# Altium project RK3576J-MB.PrjPCB (part 2 of 7)

## Sheet PWR_PMIC.SchDoc
size 420 x 297 mm; Title1str: Модуль; PageSetup: Record=PageOptions|CenterHorizontal=False|CenterVertical=False|PrintScale=0.95|XCorrection=0.00|YCorrection=0.00|PrintKind=1|BorderSize=5000000|LeftOffset=0|BottomOffset=0|Orientation=1|PaperLength=1000|PaperWidth=1000|Scale=100|PaperSource=15|PrintQuality=600|MediaType=1|DitherType=10|PaperKind=A4|PrintScaleMode=1; Title2str: ATB-LW-USB-GateWay; Mass: ---; Letter1Column: О; Letter2Column: {L}; DocumentType1str: {Документ}; DocumentType2str: {Документ}; SpravNomer: {Справ. №}; Scale: 1:1; DocumentType: Схема электрическая принципиальная; SheetNumber: 7; SheetTotal: 32; DocumentTypeShort: Э3; DocumentInvertoryNumber: ㅤ
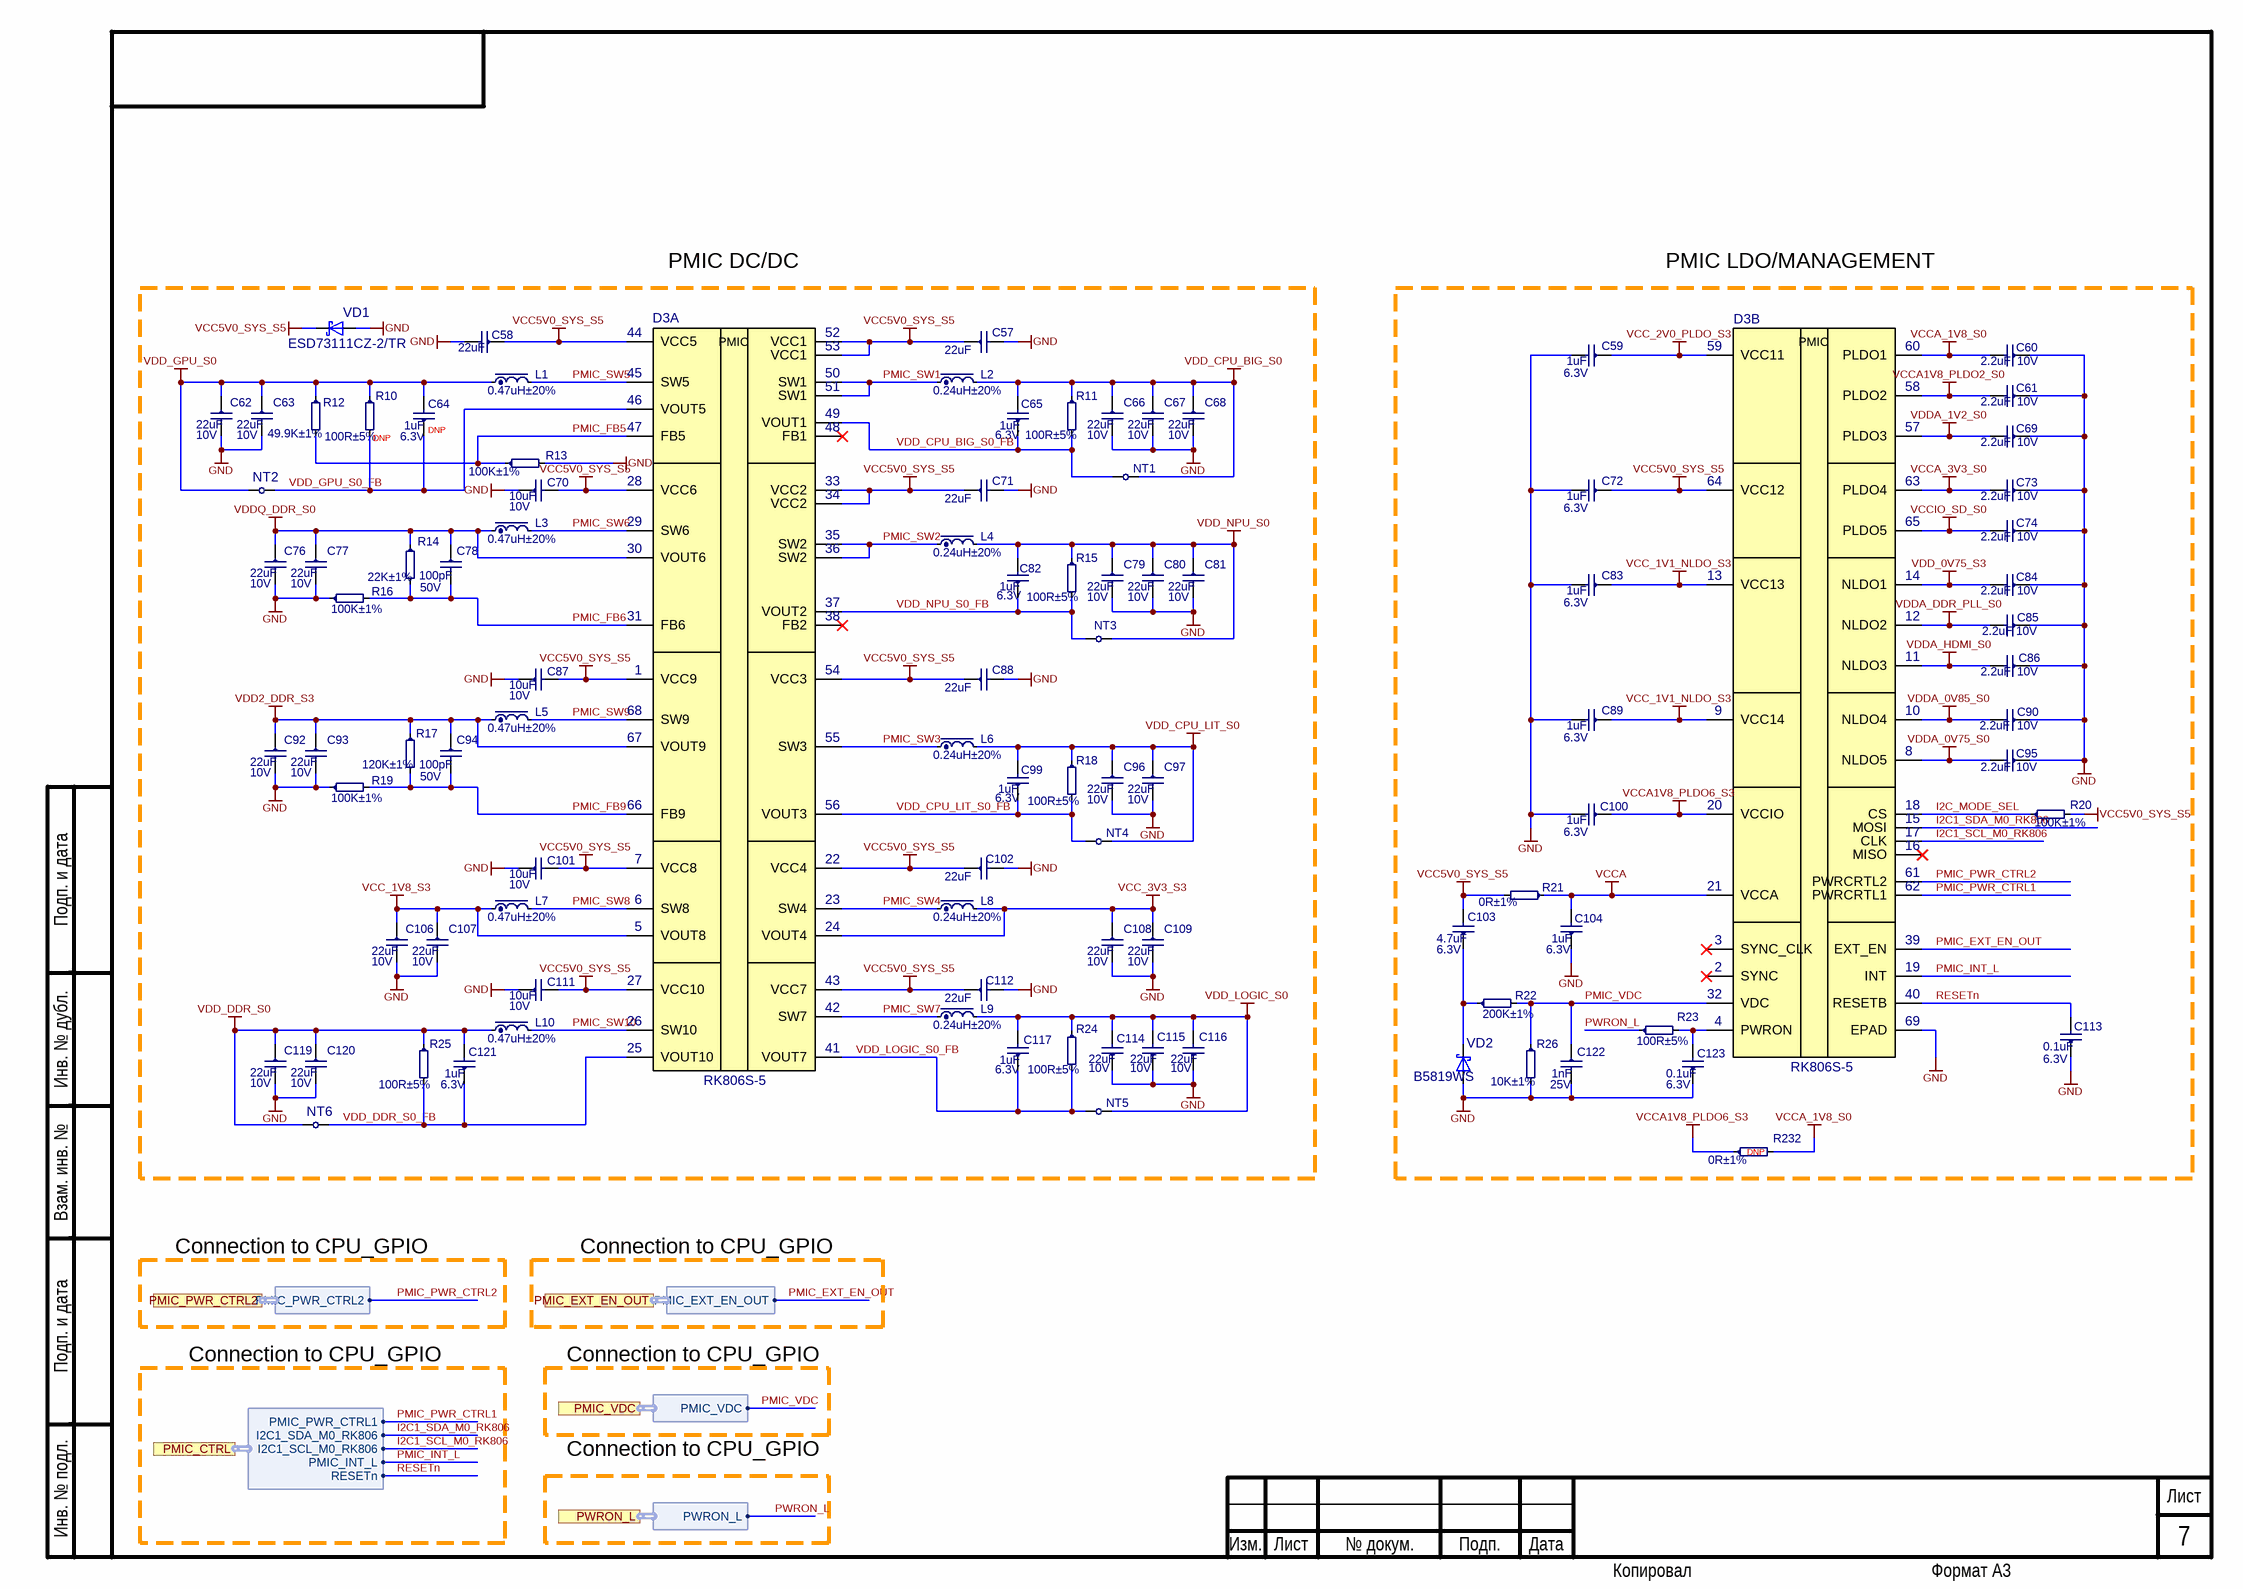
[diagram p4: PWR_PMIC.SchDoc]

### Parts
C57  22uF  [C0603]
C58  22uF  [C0603]
C59  1uF  Voltage: 6.3V  [C0201]
C60  2.2uF  Voltage: 10V  [C0402]
C61  2.2uF  Voltage: 10V  [C0402]
C62  22uF  Voltage: 10V  [C0603]
C63  22uF  Voltage: 10V  [C0603]
C64  1uF  Voltage: 6.3V  [C0201]
C65  1uF  Voltage: 6.3V  [C0201]
C66  22uF  Voltage: 10V  [C0603]
C67  22uF  Voltage: 10V  [C0603]
C68  22uF  Voltage: 10V  [C0603]
C69  2.2uF  Voltage: 10V  [C0402]
C70  10uF  Voltage: 10V  [C0603]
C71  22uF  [C0603]
C72  1uF  Voltage: 6.3V  [C0201]
C73  2.2uF  Voltage: 10V  [C0402]
C74  2.2uF  Voltage: 10V  [C0402]
C76  22uF  Voltage: 10V  [C0603]
C77  22uF  Voltage: 10V  [C0603]
C78  100pF  Voltage: 50V  [C0402]
C79  22uF  Voltage: 10V  [C0603]
C80  22uF  Voltage: 10V  [C0603]
C81  22uF  Voltage: 10V  [C0603]
C82  1uF  Voltage: 6.3V  [C0201]
C83  1uF  Voltage: 6.3V  [C0201]
C84  2.2uF  Voltage: 10V  [C0402]
C85  2.2uF  Voltage: 10V  [C0402]
C86  2.2uF  Voltage: 10V  [C0402]
C87  10uF  Voltage: 10V  [C0603]
C88  22uF  [C0603]
C89  1uF  Voltage: 6.3V  [C0201]
C90  2.2uF  Voltage: 10V  [C0402]
C92  22uF  Voltage: 10V  [C0603]
C93  22uF  Voltage: 10V  [C0603]
C94  100pF  Voltage: 50V  [C0402]
C95  2.2uF  Voltage: 10V  [C0402]
C96  22uF  Voltage: 10V  [C0603]
C97  22uF  Voltage: 10V  [C0603]
C99  1uF  Voltage: 6.3V  [C0201]
C100  1uF  Voltage: 6.3V  [C0201]
C101  10uF  Voltage: 10V  [C0603]
C102  22uF  [C0603]
C103  4.7uF  Voltage: 6.3V  [C0201]
C104  1uF  Voltage: 6.3V  [C0201]
C106  22uF  Voltage: 10V  [C0603]
C107  22uF  Voltage: 10V  [C0603]
C108  22uF  Voltage: 10V  [C0603]
C109  22uF  Voltage: 10V  [C0603]
C111  10uF  Voltage: 10V  [C0603]
C112  22uF  [C0603]
C113  0.1uF  Voltage: 6.3V  [C0201]
C114  22uF  Voltage: 10V  [C0603]
C115  22uF  Voltage: 10V  [C0603]
C116  22uF  Voltage: 10V  [C0603]
C117  1uF  Voltage: 6.3V  [C0201]
C119  22uF  Voltage: 10V  [C0603]
C120  22uF  Voltage: 10V  [C0603]
C121  1uF  Voltage: 6.3V  [C0201]
C122  1nF  Voltage: 25V  [C0201]
C123  0.1uF  Voltage: 6.3V  [C0201]
D3  RK806S-5  [RK806-1]  (parts A,B of 2)
L1  0.47uH±20%  [L0806]
L2  0.24uH±20%  [L0806]
L3  0.47uH±20%  [L0806]
L4  0.24uH±20%  [L0806]
L5  0.47uH±20%  [L0806]
L6  0.24uH±20%  [L0806]
L7  0.47uH±20%  [L0806]
L8  0.24uH±20%  [L0806]
L9  0.24uH±20%  [L0806]
L10  0.47uH±20%  [L0806]
NT1  (no value)  [NetTie_0.6mm_close]  (net tie, no BOM)
NT2  (no value)  [NetTie_0.6mm_close]  (net tie, no BOM)
NT3  (no value)  [NetTie_0.6mm_close]  (net tie, no BOM)
NT4  (no value)  [NetTie_0.6mm_close]  (net tie, no BOM)
NT5  (no value)  [NetTie_0.6mm_close]  (net tie, no BOM)
NT6  (no value)  [NetTie_0.6mm_close]  (net tie, no BOM)
R10  100R±5%  [R0201]
R11  100R±5%  [R0201]
R12  49.9K±1%  [R0402]
R13  100K±1%  [R0402]
R14  22K±1%  [R0402]
R15  100R±5%  [R0201]
R16  100K±1%  [R0402]
R17  120K±1%  [R0402]
R18  100R±5%  [R0201]
R19  100K±1%  [R0402]
R20  100K±1%  [R0201]
R21  0R±1%  [R0402]
R22  200K±1%  [R0201]
R23  100R±5%  [R0201]
R24  100R±5%  [R0201]
R25  100R±5%  [R0201]
R26  10K±1%  [R0201]
R232  0R±1%  [R0402]
VD1  ESD73111CZ-2/TR  [ESD73111CZ-2/TR]
VD2  B5819WS  [B5819WS]

### Ports
PMIC_CTRL (harness PMIC_CTRL), PMIC_EXT_EN_OUT (harness PMIC_EXT_EN_OUT), PMIC_PWR_CTRL2 (harness PMIC_PWR_CTRL2), PMIC_VDC (harness PMIC_VDC), PWRON_L (harness PWRON_L)

### Harnesses
PMIC_CTRL: I2C1_SDA_M0_RK806, I2C1_SCL_M0_RK806, PMIC_PWR_CTRL1, PMIC_INT_L, RESETn
PWRON_L: PWRON_L
PMIC_VDC: PMIC_VDC
PMIC_PWR_CTRL2: PMIC_PWR_CTRL2
PMIC_EXT_EN_OUT: PMIC_EXT_EN_OUT

### Nets
GND: C57.2 C58.2 C59.2 C60.1 C61.1 C62.2 C63.2 C66.2 C67.2 C68.2 C69.1 C70.1 C71.2 C72.2 C73.1 C74.1 C76.2 C77.2 C79.2 C80.2 C81.2 C83.2 C84.1 C85.1 C86.1 C87.1 C88.2 C89.2 C90.1 C92.2 C93.2 C95.1 C96.2 C97.2 C100.2 C101.1 C102.2 C104.1 C106.2 C107.2 C108.2 C109.2 C111.1 C112.2 C113.1 C114.1 C115.1 C116.1 C119.2 C120.2 C122.2 C123.1 D3.69(EPAD) R13.2 R16.1 R19.1 R26.2 VD1.2(A) VD2.2(A)
VCC5V0_SYS_S5: C57.1 C58.1 C70.2 C71.1 C72.1 C87.2 C88.1 C101.2 C102.1 C103.2 C111.2 C112.1 D3.1(VCC9) D3.7(VCC8) D3.22(VCC4) D3.27(VCC10) D3.28(VCC6) D3.33(VCC2) D3.34(VCC2) D3.43(VCC7) D3.44(VCC5) D3.52(VCC1) D3.53(VCC1) D3.54(VCC3) D3.64(VCC12) R20.2 R21.2 VD1.1(K)
VCC_1V1_NLDO_S3: C83.1 C89.1 D3.9(VCC14) D3.13(VCC13)
VCC_1V8_S3: C106.1 C107.1 D3.5(VOUT8) L7.1
VCC_2V0_PLDO_S3: C59.1 D3.59(VCC11)
VCC_3V3_S3: C108.1 C109.1 D3.24(VOUT4) L8.2
VCCA: C104.2 D3.21(VCCA) R21.1
VCCA1V8_PLDO2_S0: C61.2 D3.58(PLDO2)
VCCA1V8_PLDO6_S3: C100.1 D3.20(VCCIO) R232.1
VCCA_1V8_S0: C60.2 D3.60(PLDO1) R232.2
VCCA_3V3_S0: C73.2 D3.63(PLDO4)
VCCIO_SD_S0: C74.2 D3.65(PLDO5)
VDD2_DDR_S3: C92.1 C93.1 C94.1 D3.67(VOUT9) L5.1 R17.1
VDD_0V75_S3: C84.2 D3.14(NLDO1)
VDD_CPU_BIG_S0: C65.2 C66.1 C67.1 C68.1 L2.2 NT1.2 R11.1
VDD_CPU_LIT_S0: C96.1 C97.1 C99.2 L6.2 NT4.2 R18.1
VDD_DDR_S0: C119.1 C120.1 C121.2 L10.1 NT6.1 R25.1
VDD_GPU_S0: C62.1 C63.1 C64.2 L1.1 NT2.1 R10.1 R12.1
VDD_LOGIC_S0: C114.2 C115.2 C116.2 C117.2 L9.2 NT5.2 R24.1
VDD_NPU_S0: C79.1 C80.1 C81.1 C82.2 L4.2 NT3.2 R15.1
VDDA_0V75_S0: C95.2 D3.8(NLDO5)
VDDA_0V85_S0: C90.2 D3.10(NLDO4)
VDDA_1V2_S0: C69.2 D3.57(PLDO3)
VDDA_DDR_PLL_S0: C85.2 D3.12(NLDO2)
VDDA_HDMI_S0: C86.2 D3.11(NLDO3)
VDDQ_DDR_S0: C76.1 C77.1 C78.1 D3.30(VOUT6) L3.1 R14.1
I2C1_SCL_M0_RK806: D3.17(CLK) ; port PMIC_CTRL.I2C1_SCL_M0_RK806
I2C1_SDA_M0_RK806: D3.15(MOSI) ; port PMIC_CTRL.I2C1_SDA_M0_RK806
I2C_MODE_SEL: D3.18(CS) R20.1
PMIC_EXT_EN_OUT: D3.39(EXT_EN) ; port PMIC_EXT_EN_OUT.PMIC_EXT_EN_OUT
PMIC_FB5: D3.47(FB5) R12.2 R13.1
PMIC_FB6: C78.2 D3.31(FB6) R14.2 R16.2
PMIC_FB9: C94.2 D3.66(FB9) R17.2 R19.2
PMIC_INT_L: D3.19(INT) ; port PMIC_CTRL.PMIC_INT_L  [project net PMIC_CTRL.PMIC_INT_L]
PMIC_PWR_CTRL1: D3.62(PWRCRTL1) ; port PMIC_CTRL.PMIC_PWR_CTRL1  [project net PMIC_CTRL.PMIC_PWR_CTRL1]
PMIC_PWR_CTRL2: D3.61(PWRCRTL2) ; port PMIC_PWR_CTRL2.PMIC_PWR_CTRL2
PMIC_SW1: D3.50(SW1) D3.51(SW1) L2.1
PMIC_SW2: D3.35(SW2) D3.36(SW2) L4.1
PMIC_SW3: D3.55(SW3) L6.1
PMIC_SW4: D3.23(SW4) L8.1
PMIC_SW5: D3.45(SW5) L1.2
PMIC_SW6: D3.29(SW6) L3.2
PMIC_SW7: D3.42(SW7) L9.1
PMIC_SW8: D3.6(SW8) L7.2
PMIC_SW9: D3.68(SW9) L5.2
PMIC_SW10: D3.26(SW10) L10.2
PMIC_VDC: C122.1 D3.32(VDC) R22.2 R26.1 ; port PMIC_VDC.PMIC_VDC
PWRON_L: R23.1 ; port PWRON_L.PWRON_L
RESETn: C113.2 D3.40(RESETB) ; port PMIC_CTRL.RESETn  [project net PMIC_CTRL.RESETn]
VDD_CPU_BIG_S0_FB: C65.1 D3.49(VOUT1) NT1.1 R11.2
VDD_CPU_LIT_S0_FB: C99.1 D3.56(VOUT3) NT4.1 R18.2
VDD_DDR_S0_FB: C121.1 D3.25(VOUT10) NT6.2 R25.2
VDD_GPU_S0_FB: C64.1 D3.46(VOUT5) NT2.2 R10.2
VDD_LOGIC_S0_FB: C117.1 D3.41(VOUT7) NT5.1 R24.2
VDD_NPU_S0_FB: C82.1 D3.37(VOUT2) NT3.1 R15.2
NetC103_1: C103.1 R22.1 VD2.1(K)
NetC123_2: C123.2 D3.4(PWRON) R23.2

Not connected (* = marked no-connect by the designer): D3 2(SYNC)* 3(SYNC_CLK)* 16(MISO)* 38(FB2)* 48(FB1)*

### Notes on the sheet
- PMIC DC/DC
- PMIC LDO/MANAGEMENT
- (near R10) DNP
- (near C64) DNP
- (near R232) DNP
- Connection to CPU_GPIO
- Подп. и дата
- Инв. № дубл.
- Взам. инв. №
- Инв. № подл.
- Изм.
- Лист
- № докум.
- Подп.
- Дата
- Копировал
- Формат А3
- (in symbol RK806S-5, part A) PMIC
- (in symbol RK806S-5, part B) PMIC

### Library data of the parts
C57 C58 C71 C88 C102 C112 = 0603-X5R-10V-22uF±20%: *; Manufacturer: Samsung Electro-Mechanics; NameFromManufacturer: CL10A226MQ8NRNE; Dielectric: X5R; Voltage: 10V; Place: *); Tolerance: 20%; Check: False; Case: C0603; Part Number: 0603-X5R-10V-22uF±20%; Value: 22uF; Temperature: -55°C~85°C; ComponentLink2Description: Link to datasheet; ComponentLink1Description: DATASHEET; ComponentLink2URL: https://www.lcsc.com/product-detail/Multilayer-Ceramic-Capacitors-MLCC-SMD-SMT_Samsung-Electro-Mechanics-CL10A226MQ8NRNE_C159801.html; ComponentLink1URL: Datasheets/capacitors/1810261912_Samsung-Electro-Mechanics-CL10A226MQ8NRNE_C159801.pdf#Datasheets/capacitors/1810261912_Samsung-Electro-Mechanics-CL10A226MQ8NRNE_C159801.pdf#; Last changed: 05.12.2022
C59 C64 C65 C72 C82 C83 C89 C99 C100 C104 C117 C121 = 0201-X5R-6.3V-1uF±20%: Manufacturer: Murata Electronics; NameFromManufacturer: GRM033R60J105MEA2D; Dielectric: X5R; Place: *); Tolerance: 20%; Check: False; Case: C0201; Part Number: 0201-X5R-6.3V-1uF±20%; Value: 1uF; Temperature: -55°C~85°C; ComponentLink2Description: Link to datasheet; ComponentLink1Description: DATASHEET; ComponentLink2URL: https://www.terraelectronica.ru/product/1209278; ComponentLink1URL: Datasheets/capacitors/GRM033R60J105MEA2-61A.pdf; Last changed: 27.10.2022
C60 C61 C69 C73 C74 C84-C86 C90 C95 = 0402-X5R-10V-2.2uF±10%: *; Manufacturer: Yageo; NameFromManufacturer: CC0402KRX5R6BB225; Dielectric: X5R; Place: *); Tolerance: 10%; Check: False; Case: C0402; Part Number: 0402-X5R-10V-2.2uF±10%; Value: 2.2uF; Temperature: -55°C~85°C; ComponentLink2Description: Link to datasheet; ComponentLink1Description: DATASHEET; ComponentLink2URL: https://ru.mouser.com/ProductDetail/YAGEO/CC0402KRX5R6BB225?qs=%2Fha2pyFadujgDGyIaqGI8bfvbfiNNcC7p03y2QorR%252BZcRhliH8dUqw%3D%3D; ComponentLink1URL: Datasheets/capacitors/UPY-GPHC_X5R_4V-to-50V_27.pdf; Last changed: 27.10.2022
C62 C63 C66-C68 C76 C77 C79-C81 C92 C93 C96 C97 C106-C109 C114-C116 C119 C120 = 0603-X5R-10V-22uF±20%: *; Manufacturer: Samsung Electro-Mechanics; NameFromManufacturer: CL10A226MQ8NRNE; Dielectric: X5R; Place: *); Tolerance: 20%; Check: False; Case: C0603; Part Number: 0603-X5R-10V-22uF±20%; Value: 22uF; Temperature: -55°C~85°C; ComponentLink2Description: Link to datasheet; ComponentLink1Description: DATASHEET; ComponentLink2URL: https://www.lcsc.com/product-detail/Multilayer-Ceramic-Capacitors-MLCC-SMD-SMT_Samsung-Electro-Mechanics-CL10A226MQ8NRNE_C159801.html; ComponentLink1URL: Datasheets/capacitors/1810261912_Samsung-Electro-Mechanics-CL10A226MQ8NRNE_C159801.pdf#Datasheets/capacitors/1810261912_Samsung-Electro-Mechanics-CL10A226MQ8NRNE_C159801.pdf#; Last changed: 05.12.2022
C70 C87 C101 C111 = 0603-X5R-10V-10uF±10%: *; Manufacturer: Yageo; NameFromManufacturer: CC0603KRX5R6BB106; Dielectric: X5R; Place: *); Tolerance: 10%; Check: False; Case: C0603; Part Number: 0603-X5R-10V-10uF±10%; Value: 10uF; Temperature: -55°C~85°C; ComponentLink2Description: Link to datasheet; ComponentLink1Description: DATASHEET; ComponentLink2URL: https://www.yageo.com/upload/media/product/productsearch/datasheet/mlcc/UPY-GPHC_X5R_4V-to-50V_26.pdf; ComponentLink1URL: Datasheets/capacitors/UPY-GPHC_X5R_4V-to-50V_26.pdf; Last changed: 27.10.2022
C78 C94 = 0402-NP0-50V-100pF±1%: Manufacturer: Yageo; NameFromManufacturer: CC0402FRNPO9BN101; Dielectric: NP0; Place: *); Tolerance: 1%; Check: False; Case: C0402; Part Number: 0402-NP0-50V-100pF±1%; Value: 100pF; Temperature: -55°C~125°C; ComponentLink2Description: Link to datasheet; ComponentLink1Description: DATASHEET; ComponentLink2URL: https://www.yageo.com/upload/media/product/productsearch/datasheet/mlcc/UPY-GP_NP0_16V-to-50V_18.pdf; ComponentLink1URL: Datasheets/capacitors/UPY-GP_NP0_16V-to-50V_18.pdf; Last changed: 27.10.2022
C103 = 0201-X5R-6.3V-4.7uF±20%: Manufacturer: Murata Electronics; NameFromManufacturer: GRM035R60J475ME15D; Dielectric: X5R; Place: *); Tolerance: 20%; Check: False; Case: C0201; Part Number: 0201-X5R-6.3V-4.7uF±20%; Value: 4.7uF; Temperature: -55°C~85°C; ComponentLink2Description: Link to datasheet; ComponentLink1Description: DATASHEET; ComponentLink2URL: https://www.terraelectronica.ru/product/2272938; ComponentLink1URL: Datasheets/capacitors/GRM035R60J475ME15-01A.pdf; Last changed: 27.10.2022
C113 C123 = 0201-X5R-6.3V-0.1uF±10%: Manufacturer: Yageo; NameFromManufacturer: CC0201KRX5R5BB104; Dielectric: X5R; Place: *); Tolerance: 10%; Check: False; Case: C0201; Part Number: 0201-X5R-6.3V-0.1uF±10%; Value: 0.1uF; Temperature: -55°C~85°C; ComponentLink2Description: Link to datasheet; ComponentLink1Description: DATASHEET; ComponentLink2URL: https://www.terraelectronica.ru/product/1020032; ComponentLink1URL: Datasheets/capacitors/UPY-GPHC_X5R_4V-to-50V_27.pdf; Last changed: 27.10.2022
C122 = 0201-C0G-25V-100pF±5%: *; Part Number: 0201-C0G-25V-1nF±5%; Manufacturer: muRata; NameFromManufacturer: GRM0335C1E102JA01D; Dielectric: C0G; Place: *); Tolerance: 5%; Check: False; Case: C0201; Value: 1nF; Temperature: -55°C~125°C; ComponentLink2Description: Link to datasheet; ComponentLink1Description: DATASHEET; ComponentLink2URL: https://ru.mouser.com/ProductDetail/YAGEO/CC0201JRNPO8BN101?qs=%2Fha2pyFaduhl6p6a7Jtfij5kOT7C0BCbN0eDEcSOi5wWtTVDmUsGTw%3D%3D; ComponentLink1URL: Datasheets/capacitors/UPY-GP_NP0_16V-to-50V_18.pdf; Last changed: 27.10.2022
D3 = RK806S-5: Power Management; Manufacturer: Rockchip; Check: False; Part Number: RK806S-5; Value: RK806S-5; NameFromManufacturer: RK806S-5
L1 L3 L5 L7 L10 = 0806-5A-0.47uH±20%: Manufacturer: INPAQ; NameFromManufacturer: WIP201610P-R47ML; Current: 3.15A; Place: *); Value: 0.47uH; Tolerance: 20%; DC Resistance: 0.026R; Check: False; Case: XXXX; Part Number: 0806-5A-0.47uH±20%; Temperature: -55°C~125°C; ComponentLink1Description: DATASHEET; ComponentLink1URL: https://www.terraelectronica.ru/product/3409769; Datasheet: Datasheets/inductors/J(E)TE243A-0006.pdf; Last changed: 27.10.2022
L2 L4 L6 L8 L9 = 0806-5A-0.47uH±20%: Part Number: 0806-4.4A-0.24uH±20%; Manufacturer: cjiang; NameFromManufacturer: FPA201612D-R24MT0; Current: 4.4A; Place: *); Value: 0.24uH; Tolerance: 20%; DC Resistance: 0.026R; Check: False; Case: XXXX; Temperature: -55°C~125°C; ComponentLink1Description: DATASHEET; ComponentLink1URL: https://www.terraelectronica.ru/product/3409769; Datasheet: Datasheets/inductors/J(E)TE243A-0006.pdf; Last changed: 27.10.2022
NT1-NT6 = Перемычка закрытая_0.6мм: Check: False; Part Number: Перемычка закрытая_0.6мм; ComponentLink1Description: DATASHEET; Last changed: 06.05.2021
R10 R11 R15 R18 R23-R25 = 0201-0.05W-100R-200ppm-5%: *; NameFromManufacturer: RC0201JR-07100RL; Manufacturer: Yageo; Place: *); Value: 100R; Tolerance: 5%; Check: False; Case: R0201; Part Number: 0201-0.05W-100R-200ppm-5%; Temperature: -40°C~125°C; ComponentLink1Description: DATASHEET; ComponentLink1URL: https://www.terraelectronica.ru/product/431790; Datasheet: Datasheets/resistors/PYu-RC_Group_51_RoHS_L_11.pdf; Last changed: 27.10.2022
R12 = 0402-0.0625W-49.9K-100ppm±1%: Chip Resistor 0402 49.9kΩ ±1% 50V ±100ppm/℃ Thick Film; NameFromManufacturer: RC0402FR-0749K9L; Manufacturer: Yageo; Place: *); Value: 49.9K; Check: False; Case: R0402; Part Number: 0402-0.0625W-49.9K-100ppm±1%; Tolerance: 1%; Temperature: -55°C~155°C; ComponentLink1Description: DATASHEET; ComponentLink1URL: https://www.terraelectronica.ru/product/562862; Datasheet: Datasheets/resistors/PYu-RC_Group_51_RoHS_L_11.pdf; Last changed: 27.10.2022
R13 R16 R19 = 0402-0.0625W-100K-100ppm±1%: Chip Resistor 0402 100kΩ ±1% 50V ±100ppm/℃ Thick Film; NameFromManufacturer: RC0402FR-07100KL; Manufacturer: Yageo; Place: *); Value: 100K; Check: False; Case: R0402; Part Number: 0402-0.0625W-100K-100ppm±1%; Tolerance: 1%; Temperature: -55°C~155°C; ComponentLink1Description: DATASHEET; ComponentLink1URL: https://www.yageo.com/upload/media/product/productsearch/datasheet/rchip/PYu-RC_Group_51_RoHS_L_11.pdf; Datasheet: Datasheets/resistors/PYu-RC_Group_51_RoHS_L_11.pdf; Last changed: 27.10.2022
R14 = 0402-0.0625W-22K-100ppm±1%: *; NameFromManufacturer: RC0402FR-0722KL; Manufacturer: Yageo; Place: *); Value: 22K; Tolerance: 1%; Check: False; Case: R0402; Part Number: 0402-0.0625W-22K-100ppm±1%; Temperature: -55°C~155°C; ComponentLink1Description: DATASHEET; ComponentLink1URL: https://www.digikey.com/en/products/detail/yageo/RC0402FR-0722KL/726561?s=N4IgTCBcDaIEoGEAMAWJYBicC0SDsYYA0gDIgC6AvkA; Datasheet: Datasheets/resistors/PYu-RC_Group_51_RoHS_L_11.pdf; Last changed: 27.10.2022
R17 = 0402-0.0625W-120K-100ppm±1%: NameFromManufacturer: RC0402FR-07120KL; Manufacturer: Yageo; Place: *); Value: 120K; Tolerance: 1%; Check: False; Case: R0402; Part Number: 0402-0.0625W-120K-100ppm±1%; Temperature: -55°C~155°C; ComponentLink1Description: DATASHEET; ComponentLink1URL: https://eu.mouser.com/ProductDetail/YAGEO/RC0402FR-07120KL?qs=sxZXDnvRBEiD8SsZ%252BM9D1g%3D%3D; Datasheet: Datasheets/resistors/PYu-RC_Group_51_RoHS_L_11.pdf; Last changed: 27.10.2022
R20 = 0201-0.05W-0R-100ppm-5%: *; Part Number: 0201-0.05W-100K-5%; NameFromManufacturer: RC0201FR-07100KL; Manufacturer: Yageo; Place: *); Value: 100K; Tolerance: 1%; Check: False; Case: R0201; Temperature: -40°C~125°C; ComponentLink1Description: DATASHEET; ComponentLink1URL: https://www.digikey.com/en/products/detail/yageo/RC0201JR-070RL/1948898; Datasheet: Datasheets/resistors/PYu-RC_Group_51_RoHS_L_11.pdf+BB3:B271; Last changed: 27.10.2022
R21 R232 = 0402-0.0625W-0R-100ppm±1%: as R52 on sheet PWR_MAIN; Case: R0402; Part Number: 0402-0.0625W-0R-100ppm±1%; Tolerance: 1%; Temperature: -55°C~155°C; ComponentLink1Description: DATASHEET; ComponentLink1URL: https://www.chipdip.ru/product0/8000617426?ysclid=l7og5x0plo427794326; Datasheet: Datasheets/resistors/DOC012445956.pdf; Last changed: 27.10.2022
R22 = 0201-0.05W-0R-100ppm-5%: *; Part Number: 0201-0.05W-200K-100ppm-1%; NameFromManufacturer: RC0201FR-07200KL; Manufacturer: Yageo; Place: *); Value: 200K; Tolerance: 1%; Check: False; Case: R0201; Temperature: -40°C~125°C; ComponentLink1Description: DATASHEET; ComponentLink1URL: https://www.digikey.com/en/products/detail/yageo/RC0201JR-070RL/1948898; Datasheet: Datasheets/resistors/PYu-RC_Group_51_RoHS_L_11.pdf+BB3:B271; Last changed: 27.10.2022
R26 = 0201-0.05W-0R-100ppm-5%: *; Part Number: 0201-0.05W-10K-100ppm-1%; NameFromManufacturer: RC0201FR-0710KL; Manufacturer: Yageo; Place: *); Value: 10K; Tolerance: 1%; Check: False; Case: R0201; Temperature: -40°C~125°C; ComponentLink1Description: DATASHEET; ComponentLink1URL: https://www.digikey.com/en/products/detail/yageo/RC0201JR-070RL/1948898; Datasheet: Datasheets/resistors/PYu-RC_Group_51_RoHS_L_11.pdf+BB3:B271; Last changed: 27.10.2022
VD1 = ESD73111CZ-2/TR: 6.5VC Clamp 6A@8/20us Ipp ESD DIODE DWN0603-2L; Manufacturer: WILLSEMI; Check: False; Part Number: ESD73111CZ-2/TR; Value: ESD73111CZ-2/TR; NameFromManufacturer: ESD73111CZ-2/TR
VD2 = B5819WS: Rectifier Diode, Schottky, 1 Phase, 1 Element, 1A, 40V V(RRM), Silicon; Check: False; Part Number: B5819WS; Value: B5819WS; NameFromManufacturer: B5819WS

## Sheet PWR_CPU.SchDoc
size 420 x 297 mm; Scale: 1:1; DocumentType: Схема электрическая принципиальная; SheetNumber: 8; SheetTotal: 32; DocumentTypeShort: Э3; DocumentInvertoryNumber: ㅤ
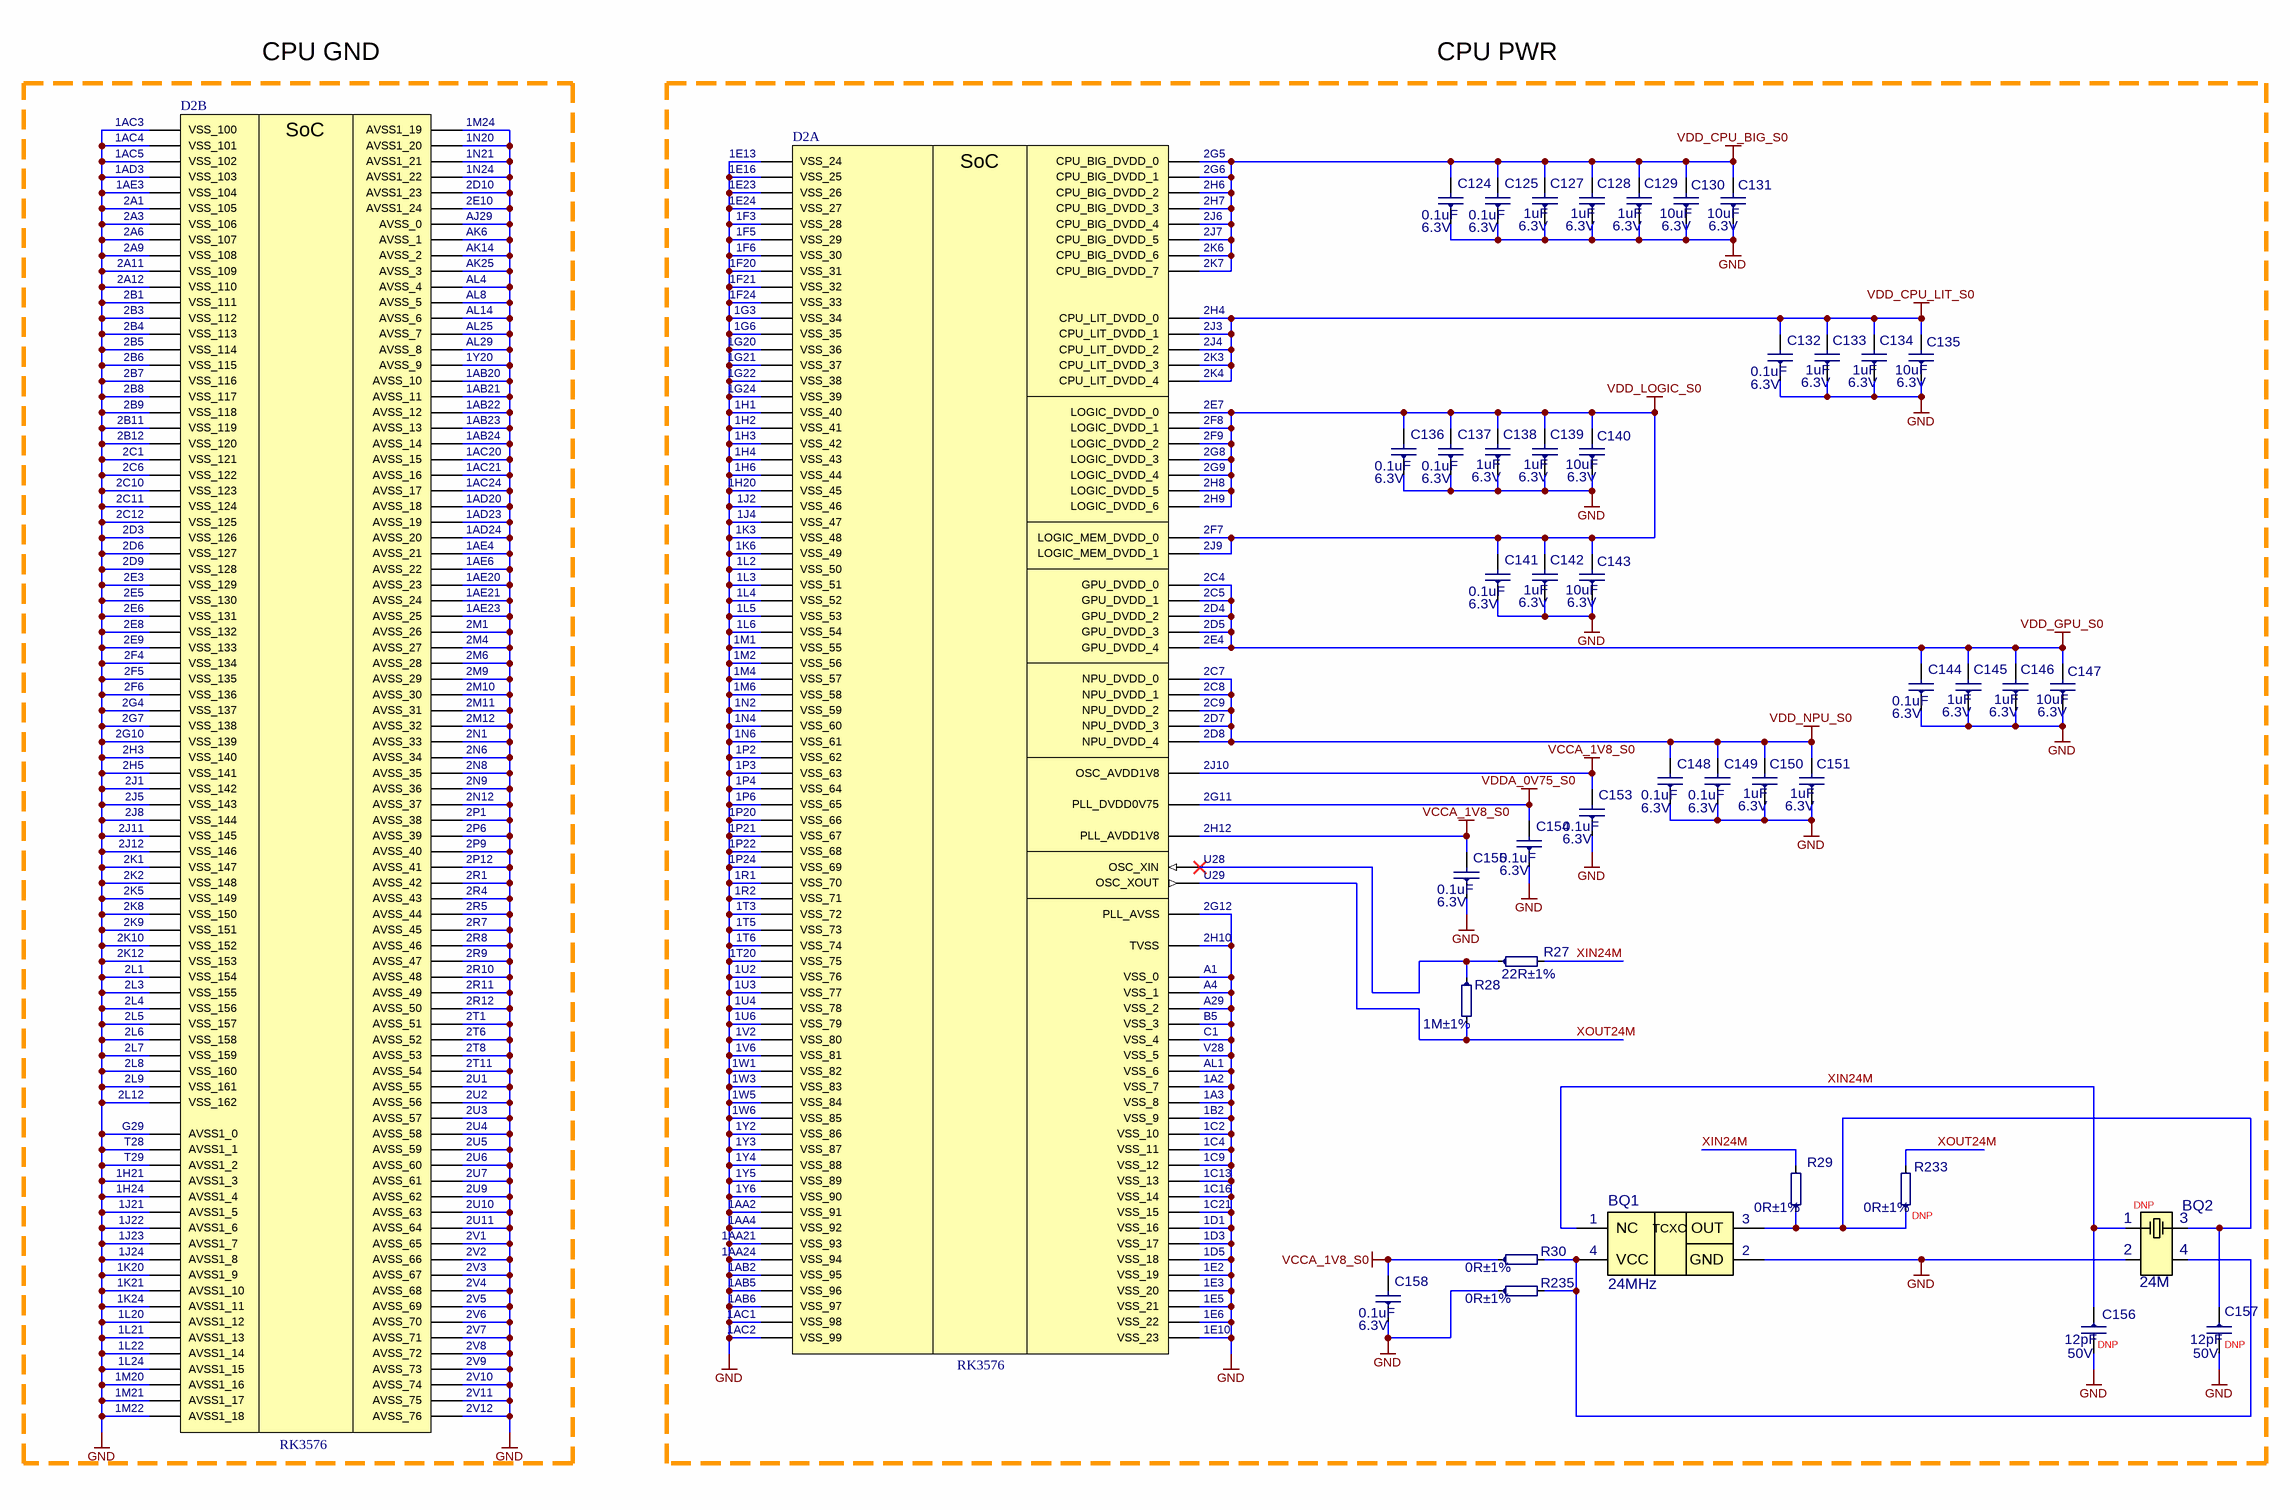
[diagram p5: PWR_CPU.SchDoc]

### Parts
BQ1  24MHz  [TC32S4-24.000-0618NQDTN]
BQ2  24M  [NX3225GA]
C124  0.1uF  Voltage: 6.3V  [C0201]
C125  0.1uF  Voltage: 6.3V  [C0201]
C127  1uF  Voltage: 6.3V  [C0201]
C128  1uF  Voltage: 6.3V  [C0201]
C129  1uF  Voltage: 6.3V  [C0201]
C130  10uF  Voltage: 6.3V  [C0402]
C131  10uF  Voltage: 6.3V  [C0402]
C132  0.1uF  Voltage: 6.3V  [C0201]
C133  1uF  Voltage: 6.3V  [C0201]
C134  1uF  Voltage: 6.3V  [C0201]
C135  10uF  Voltage: 6.3V  [C0402]
C136  0.1uF  Voltage: 6.3V  [C0201]
C137  0.1uF  Voltage: 6.3V  [C0201]
C138  1uF  Voltage: 6.3V  [C0201]
C139  1uF  Voltage: 6.3V  [C0201]
C140  10uF  Voltage: 6.3V  [C0402]
C141  0.1uF  Voltage: 6.3V  [C0201]
C142  1uF  Voltage: 6.3V  [C0201]
C143  10uF  Voltage: 6.3V  [C0402]
C144  0.1uF  Voltage: 6.3V  [C0201]
C145  1uF  Voltage: 6.3V  [C0201]
C146  1uF  Voltage: 6.3V  [C0201]
C147  10uF  Voltage: 6.3V  [C0402]
C148  0.1uF  Voltage: 6.3V  [C0201]
C149  0.1uF  Voltage: 6.3V  [C0201]
C150  1uF  Voltage: 6.3V  [C0201]
C151  1uF  Voltage: 6.3V  [C0201]
C153  0.1uF  Voltage: 6.3V  [C0201]
C154  0.1uF  Voltage: 6.3V  [C0201]
C155  0.1uF  Voltage: 6.3V  [C0201]
C156  12pF  Voltage: 50V  [C0402]
C157  12pF  Voltage: 50V  [C0402]
C158  0.1uF  Voltage: 6.3V  [C0201]
D2  RK3576  [BGAFCCSP698L]  (parts A,B of 7)
R27  22R±1%  [R0402]
R28  1M±1%  [R0402]
R29  0R±1%  [R0402]
R30  0R±1%  [R0402]
R233  0R±1%  [R0402]
R235  0R±1%  [R0402]

### Nets
GND: BQ1.2(GND) BQ2.2 C124.1 C125.1 C127.1 C128.1 C129.1 C130.1 C131.1 C132.1 C133.1 C134.1 C135.1 C136.1 C137.1 C138.1 C139.1 C140.1 C141.1 C142.1 C143.1 C144.1 C145.1 C146.1 C147.1 C148.1 C149.1 C150.1 C151.1 C153.1 C154.1 C155.1 C156.2 C157.2 C158.1 D2.1A2(VSS_7) D2.1A3(VSS_8) D2.1AA2(VSS_91) D2.1AA4(VSS_92) D2.1AA21(VSS_93) D2.1AA24(VSS_94) D2.1AB2(VSS_95) D2.1AB5(VSS_96) D2.1AB6(VSS_97) D2.1AB20(AVSS_10) D2.1AB21(AVSS_11) D2.1AB22(AVSS_12) D2.1AB23(AVSS_13) D2.1AB24(AVSS_14) D2.1AC1(VSS_98) D2.1AC2(VSS_99) D2.1AC3(VSS_100) D2.1AC4(VSS_101) D2.1AC5(VSS_102) D2.1AC20(AVSS_15) D2.1AC21(AVSS_16) D2.1AC24(AVSS_17) D2.1AD3(VSS_103) D2.1AD20(AVSS_18) D2.1AD23(AVSS_19) D2.1AD24(AVSS_20) D2.1AE3(VSS_104) D2.1AE4(AVSS_21) D2.1AE6(AVSS_22) D2.1AE20(AVSS_23) D2.1AE21(AVSS_24) D2.1AE23(AVSS_25) D2.1B2(VSS_9) D2.1C2(VSS_10) D2.1C4(VSS_11) D2.1C9(VSS_12) D2.1C13(VSS_13) D2.1C16(VSS_14) D2.1C21(VSS_15) D2.1D1(VSS_16) D2.1D3(VSS_17) D2.1D5(VSS_18) D2.1E2(VSS_19) D2.1E3(VSS_20) D2.1E5(VSS_21) D2.1E6(VSS_22) D2.1E10(VSS_23) D2.1E13(VSS_24) D2.1E16(VSS_25) D2.1E23(VSS_26) D2.1E24(VSS_27) D2.1F3(VSS_28) D2.1F5(VSS_29) D2.1F6(VSS_30) D2.1F20(VSS_31) D2.1F21(VSS_32) D2.1F24(VSS_33) D2.1G3(VSS_34) D2.1G6(VSS_35) D2.1G20(VSS_36) D2.1G21(VSS_37) D2.1G22(VSS_38) D2.1G24(VSS_39) D2.1H1(VSS_40) D2.1H2(VSS_41) D2.1H3(VSS_42) D2.1H4(VSS_43) D2.1H6(VSS_44) D2.1H20(VSS_45) D2.1H21(AVSS1_3) D2.1H24(AVSS1_4) D2.1J2(VSS_46) D2.1J4(VSS_47) D2.1J21(AVSS1_5) D2.1J22(AVSS1_6) D2.1J23(AVSS1_7) D2.1J24(AVSS1_8) D2.1K3(VSS_48) D2.1K6(VSS_49) D2.1K20(AVSS1_9) D2.1K21(AVSS1_10) D2.1K24(AVSS1_11) D2.1L2(VSS_50) D2.1L3(VSS_51) D2.1L4(VSS_52) D2.1L5(VSS_53) D2.1L6(VSS_54) D2.1L20(AVSS1_12) D2.1L21(AVSS1_13) D2.1L22(AVSS1_14) D2.1L24(AVSS1_15) D2.1M1(VSS_55) D2.1M2(VSS_56) D2.1M4(VSS_57) D2.1M6(VSS_58) D2.1M20(AVSS1_16) D2.1M21(AVSS1_17) D2.1M22(AVSS1_18) D2.1M24(AVSS1_19) D2.1N2(VSS_59) D2.1N4(VSS_60) D2.1N6(VSS_61) D2.1N20(AVSS1_20) D2.1N21(AVSS1_21) D2.1N24(AVSS1_22) D2.1P2(VSS_62) D2.1P3(VSS_63) D2.1P4(VSS_64) D2.1P6(VSS_65) D2.1P20(VSS_66) D2.1P21(VSS_67) D2.1P22(VSS_68) D2.1P24(VSS_69) D2.1R1(VSS_70) D2.1R2(VSS_71) D2.1T3(VSS_72) D2.1T5(VSS_73) D2.1T6(VSS_74) D2.1T20(VSS_75) D2.1U2(VSS_76) D2.1U3(VSS_77) D2.1U4(VSS_78) D2.1U6(VSS_79) D2.1V2(VSS_80) D2.1V6(VSS_81) D2.1W1(VSS_82) D2.1W3(VSS_83) D2.1W5(VSS_84) D2.1W6(VSS_85) D2.1Y2(VSS_86) D2.1Y3(VSS_87) D2.1Y4(VSS_88) D2.1Y5(VSS_89) D2.1Y6(VSS_90) D2.1Y20(AVSS_9) D2.2A1(VSS_105) D2.2A3(VSS_106) D2.2A6(VSS_107) D2.2A9(VSS_108) D2.2A11(VSS_109) D2.2A12(VSS_110) D2.2B1(VSS_111) D2.2B3(VSS_112) D2.2B4(VSS_113) D2.2B5(VSS_114) D2.2B6(VSS_115) D2.2B7(VSS_116) D2.2B8(VSS_117) D2.2B9(VSS_118) D2.2B11(VSS_119) D2.2B12(VSS_120) D2.2C1(VSS_121) D2.2C6(VSS_122) D2.2C10(VSS_123) D2.2C11(VSS_124) D2.2C12(VSS_125) D2.2D3(VSS_126) D2.2D6(VSS_127) D2.2D9(VSS_128) D2.2D10(AVSS1_23) D2.2E3(VSS_129) D2.2E5(VSS_130) D2.2E6(VSS_131) D2.2E8(VSS_132) D2.2E9(VSS_133) D2.2E10(AVSS1_24) D2.2F4(VSS_134) D2.2F5(VSS_135) D2.2F6(VSS_136) D2.2G4(VSS_137) D2.2G7(VSS_138) D2.2G10(VSS_139) D2.2G12(PLL_AVSS) D2.2H3(VSS_140) D2.2H5(VSS_141) D2.2H10(TVSS) D2.2J1(VSS_142) D2.2J5(VSS_143) D2.2J8(VSS_144) D2.2J11(VSS_145) D2.2J12(VSS_146) D2.2K1(VSS_147) D2.2K2(VSS_148) D2.2K5(VSS_149) D2.2K8(VSS_150) D2.2K9(VSS_151) D2.2K10(VSS_152) D2.2K12(VSS_153) D2.2L1(VSS_154) D2.2L3(VSS_155) D2.2L4(VSS_156) D2.2L5(VSS_157) D2.2L6(VSS_158) D2.2L7(VSS_159) D2.2L8(VSS_160) D2.2L9(VSS_161) D2.2L12(VSS_162) D2.2M1(AVSS_26) D2.2M4(AVSS_27) D2.2M6(AVSS_28) D2.2M9(AVSS_29) D2.2M10(AVSS_30) D2.2M11(AVSS_31) D2.2M12(AVSS_32) D2.2N1(AVSS_33) D2.2N6(AVSS_34) D2.2N8(AVSS_35) D2.2N9(AVSS_36) D2.2N12(AVSS_37) D2.2P1(AVSS_38) D2.2P6(AVSS_39) D2.2P9(AVSS_40) D2.2P12(AVSS_41) D2.2R1(AVSS_42) D2.2R4(AVSS_43) D2.2R5(AVSS_44) D2.2R7(AVSS_45) D2.2R8(AVSS_46) D2.2R9(AVSS_47) D2.2R10(AVSS_48) D2.2R11(AVSS_49) D2.2R12(AVSS_50) D2.2T1(AVSS_51) D2.2T6(AVSS_52) D2.2T8(AVSS_53) D2.2T11(AVSS_54) D2.2U1(AVSS_55) D2.2U2(AVSS_56) D2.2U3(AVSS_57) D2.2U4(AVSS_58) D2.2U5(AVSS_59) D2.2U6(AVSS_60) D2.2U7(AVSS_61) D2.2U9(AVSS_62) D2.2U10(AVSS_63) D2.2U11(AVSS_64) D2.2V1(AVSS_65) D2.2V2(AVSS_66) D2.2V3(AVSS_67) D2.2V4(AVSS_68) D2.2V5(AVSS_69) D2.2V6(AVSS_70) D2.2V7(AVSS_71) D2.2V8(AVSS_72) D2.2V9(AVSS_73) D2.2V10(AVSS_74) D2.2V11(AVSS_75) D2.2V12(AVSS_76) D2.A1(VSS_0) D2.A4(VSS_1) D2.A29(VSS_2) D2.AJ29(AVSS_0) D2.AK6(AVSS_1) D2.AK14(AVSS_2) D2.AK25(AVSS_3) D2.AL1(VSS_6) D2.AL4(AVSS_4) D2.AL8(AVSS_5) D2.AL14(AVSS_6) D2.AL25(AVSS_7) D2.AL29(AVSS_8) D2.B5(VSS_3) D2.C1(VSS_4) D2.G29(AVSS1_0) D2.T28(AVSS1_1) D2.T29(AVSS1_2) D2.V28(VSS_5) R235.1
VCCA_1V8_S0: C153.2 C155.2 C158.2 D2.2H12(PLL_AVDD1V8) D2.2J10(OSC_AVDD1V8) R30.1
VDD_CPU_BIG_S0: C124.2 C125.2 C127.2 C128.2 C129.2 C130.2 C131.2 D2.2G5(CPU_BIG_DVDD_0) D2.2G6(CPU_BIG_DVDD_1) D2.2H6(CPU_BIG_DVDD_2) D2.2H7(CPU_BIG_DVDD_3) D2.2J6(CPU_BIG_DVDD_4) D2.2J7(CPU_BIG_DVDD_5) D2.2K6(CPU_BIG_DVDD_6) D2.2K7(CPU_BIG_DVDD_7)
VDD_CPU_LIT_S0: C132.2 C133.2 C134.2 C135.2 D2.2H4(CPU_LIT_DVDD_0) D2.2J3(CPU_LIT_DVDD_1) D2.2J4(CPU_LIT_DVDD_2) D2.2K3(CPU_LIT_DVDD_3) D2.2K4(CPU_LIT_DVDD_4)
VDD_GPU_S0: C144.2 C145.2 C146.2 C147.2 D2.2C4(GPU_DVDD_0) D2.2C5(GPU_DVDD_1) D2.2D4(GPU_DVDD_2) D2.2D5(GPU_DVDD_3) D2.2E4(GPU_DVDD_4)
VDD_LOGIC_S0: C136.2 C137.2 C138.2 C139.2 C140.2 C141.2 C142.2 C143.2 D2.2E7(LOGIC_DVDD_0) D2.2F7(LOGIC_MEM_DVDD_0) D2.2F8(LOGIC_DVDD_1) D2.2F9(LOGIC_DVDD_2) D2.2G8(LOGIC_DVDD_3) D2.2G9(LOGIC_DVDD_4) D2.2H8(LOGIC_DVDD_5) D2.2H9(LOGIC_DVDD_6) D2.2J9(LOGIC_MEM_DVDD_1)
VDD_NPU_S0: C148.2 C149.2 C150.2 C151.2 D2.2C7(NPU_DVDD_0) D2.2C8(NPU_DVDD_1) D2.2C9(NPU_DVDD_2) D2.2D7(NPU_DVDD_3) D2.2D8(NPU_DVDD_4)
VDDA_0V75_S0: C154.2 D2.2G11(PLL_DVDD0V75)
XIN24M: BQ1.1(NC) BQ2.1 C156.1 R27.2 R29.2
XOUT24M: D2.U29(OSC_XOUT) R28.2 R233.2
NetBQ1_3: BQ1.3(OUT) BQ2.3 C157.1 R29.1 R233.1
NetBQ1_4: BQ1.4(VCC) BQ2.4 R30.2 R235.2
NetD2_U28: D2.U28(OSC_XIN) R27.1 R28.1

### Notes on the sheet
- CPU GND
- CPU PWR
- (near BQ2) DNP
- (near R233) DNP
- (near C156) DNP
- (near C157) DNP
- Подп. и дата
- Инв. № дубл.
- Взам. инв. №
- Инв. № подл.
- Изм.
- Лист
- № докум.
- Подп.
- Дата
- Копировал
- Формат А3
- (in symbol RK3576, part A) SoC
- (in symbol RK3576, part B) SoC
- (in symbol TC32S4-24.000-0618NQDTN) TCXO

### Library data of the parts
BQ1 = TC32S4-24.000-0618NQDTN: TCXO SMD 3.2x2.5, Clipped Sine, 1.8V; Manufacturer: HCI; Check: False; Analogs: ECS-TXO-3225MV-240-TR; Part Number: TC32S4-24.000-0618NQDTN; Value: 24MHz; NameFromManufacturer: TC32S4-24.000-0618NQDTN
BQ2 = NX3225GA-24M-18pF-10ppm: Part Number: 3225-24-18-10-10/4B; Manufacturer: Liming; Place: S; Tolerance: 10ppm; Check: False; Value: 24M; NameFromManufacturer: 3225-24-18-10-10/4B; ComponentLink1Description: DATASHEET; ComponentLink1URL: https://www.raltron.com/wp-content/uploads/2019/07/RH100_SERIES-July-2019.pdf; Last changed: 27.10.2022
C124 C125 C132 C136 C137 C141 C144 C148 C149 C153-C155 C158 = 0201-X5R-6.3V-0.1uF±10%: Manufacturer: Yageo; NameFromManufacturer: CC0201KRX5R5BB104; Dielectric: X5R; Place: *); Tolerance: 10%; Check: False; Case: C0201; Part Number: 0201-X5R-6.3V-0.1uF±10%; Value: 0.1uF; Temperature: -55°C~85°C; ComponentLink2Description: Link to datasheet; ComponentLink1Description: DATASHEET; ComponentLink2URL: https://www.terraelectronica.ru/product/1020032; ComponentLink1URL: Datasheets/capacitors/UPY-GPHC_X5R_4V-to-50V_27.pdf; Last changed: 27.10.2022
C127-C129 C133 C134 C138 C139 C142 C145 C146 C150 C151 = 0201-X5R-6.3V-1uF±20%: Manufacturer: Murata Electronics; NameFromManufacturer: GRM033R60J105MEA2D; Dielectric: X5R; Place: *); Tolerance: 20%; Check: False; Case: C0201; Part Number: 0201-X5R-6.3V-1uF±20%; Value: 1uF; Temperature: -55°C~85°C; ComponentLink2Description: Link to datasheet; ComponentLink1Description: DATASHEET; ComponentLink2URL: https://www.terraelectronica.ru/product/1209278; ComponentLink1URL: Datasheets/capacitors/GRM033R60J105MEA2-61A.pdf; Last changed: 27.10.2022
C130 C131 C135 C140 C143 C147 = 0402-X5R-6.3V-10uF±20%: Manufacturer: Yageo; NameFromManufacturer: CC0402MRX5R5BB106; Dielectric: X5R; Place: *); Tolerance: 20%; Check: False; Case: C0402; Part Number: 0402-X5R-6.3V-10uF±20%; Value: 10uF; Temperature: -55°C~125°C; ComponentLink2Description: Link to datasheet; ComponentLink1Description: DATASHEET; ComponentLink2URL: https://ru.mouser.com/ProductDetail/YAGEO/CC0402MRX5R5BB106?qs=%2Fha2pyFadujQAk9rG2cgJj8l7IbODD3KVaDjvxAcKzu9LtlLnRlq6Q%3D%3D; ComponentLink1URL: Datasheets/capacitors/UPY-GPHC_X5R_4V-to-50V_27.pdf; Last changed: 27.10.2022
C156 C157 = 0402-NP0-50V-12pF±5%: Manufacturer: Murata Electronics; NameFromManufacturer: GRM1555C1H120JA01D; Dielectric: NP0; Place: *); Tolerance: 5%; Check: False; Case: C0402; Part Number: 0402-NP0-50V-12pF±5%; Value: 12pF; Temperature: -55°C~125°C; ComponentLink2Description: Link to datasheet; ComponentLink1Description: DATASHEET; ComponentLink2URL: https://www.terraelectronica.ru/pdf/show?pdf_file=http%253A%252F%252Fwww.farnell.com%252Fdatasheets%252F2048662.pdf; ComponentLink1URL: Datasheets/capacitors/GRM1555C1H120JA01-01A.pdf; Last changed: 27.10.2022
D2 = RK3576: SoC 4xCortex-A72@2.2Ghz+4xCortex-A53@2Ghz, LPDDR4/4X/5/5X, SDIO/eMMC/UFS/FSPI, BGA 16.1x17.2x1.0mm; Manufacturer: Rockship; Place: *); Check: False; Part Number: RK3576; Temperature: -40°C~85°C; Value: RK3576; ComponentLink1Description: DATASHEET; NameFromManufacturer: RK3576; ComponentLink1URL: https://wiki.friendlyelec.com/wiki/images/b/bf/Rockchip_RK3576_Datasheet_V1.5-20241216.pdf; Last changed: 06.01.2026
R27 = 0402-0.0625W-22R-100ppm±1%: Chip Resistor 0402 22Ω ±1% 50V ±100ppm/℃ Thick Film; NameFromManufacturer: RC0402FR-0722RL; Manufacturer: Yageo; Place: *); Value: 22R; Check: False; Case: R0402; Part Number: 0402-0.0625W-22R-100ppm±1%; Tolerance: 1%; Temperature: -55°C~155°C; ComponentLink1Description: DATASHEET; ComponentLink1URL: https://www.yageo.com/upload/media/product/productsearch/datasheet/rchip/PYu-RC_Group_51_RoHS_L_11.pdf; Datasheet: Datasheets/resistors/PYu-RC_Group_51_RoHS_L_11.pdf; Last changed: 27.10.2022
R28 = 0402-0.0625W-1M-100ppm±1%: Chip Resistor 0402 1MΩ ±1% 50V ±100ppm/℃ Thick Film; NameFromManufacturer: RC0402FR-071ML; Manufacturer: Yageo; Place: *); Value: 1M; Check: False; Case: R0402; Part Number: 0402-0.0625W-1M-100ppm±1%; Tolerance: 1%; Temperature: -55°C~155°C; ComponentLink1Description: DATASHEET; ComponentLink1URL: https://www.yageo.com/upload/media/product/productsearch/datasheet/rchip/PYu-RC_Group_51_RoHS_L_11.pdf; Datasheet: Datasheets/resistors/PYu-RC_Group_51_RoHS_L_11.pdf; Last changed: 27.10.2022
R29 R30 R233 R235 = 0402-0.0625W-0R-100ppm±1%: Chip Resistor 0402 0Ω ±1% 50V ±100ppm/℃ Thick Film; NameFromManufacturer: RC0402FR-070RL; Manufacturer: Yageo; Place: *); Value: 0R; Check: False; Case: R0402; Part Number: 0402-0.0625W-0R-100ppm±1%; Tolerance: 1%; Temperature: -55°C~155°C; ComponentLink1Description: DATASHEET; ComponentLink1URL: https://www.chipdip.ru/product0/8000617426?ysclid=l7og5x0plo427794326; Datasheet: Datasheets/resistors/DOC012445956.pdf; Last changed: 27.10.2022